# EAGLE design duckypad_evo (EAGLE 9.6.2)
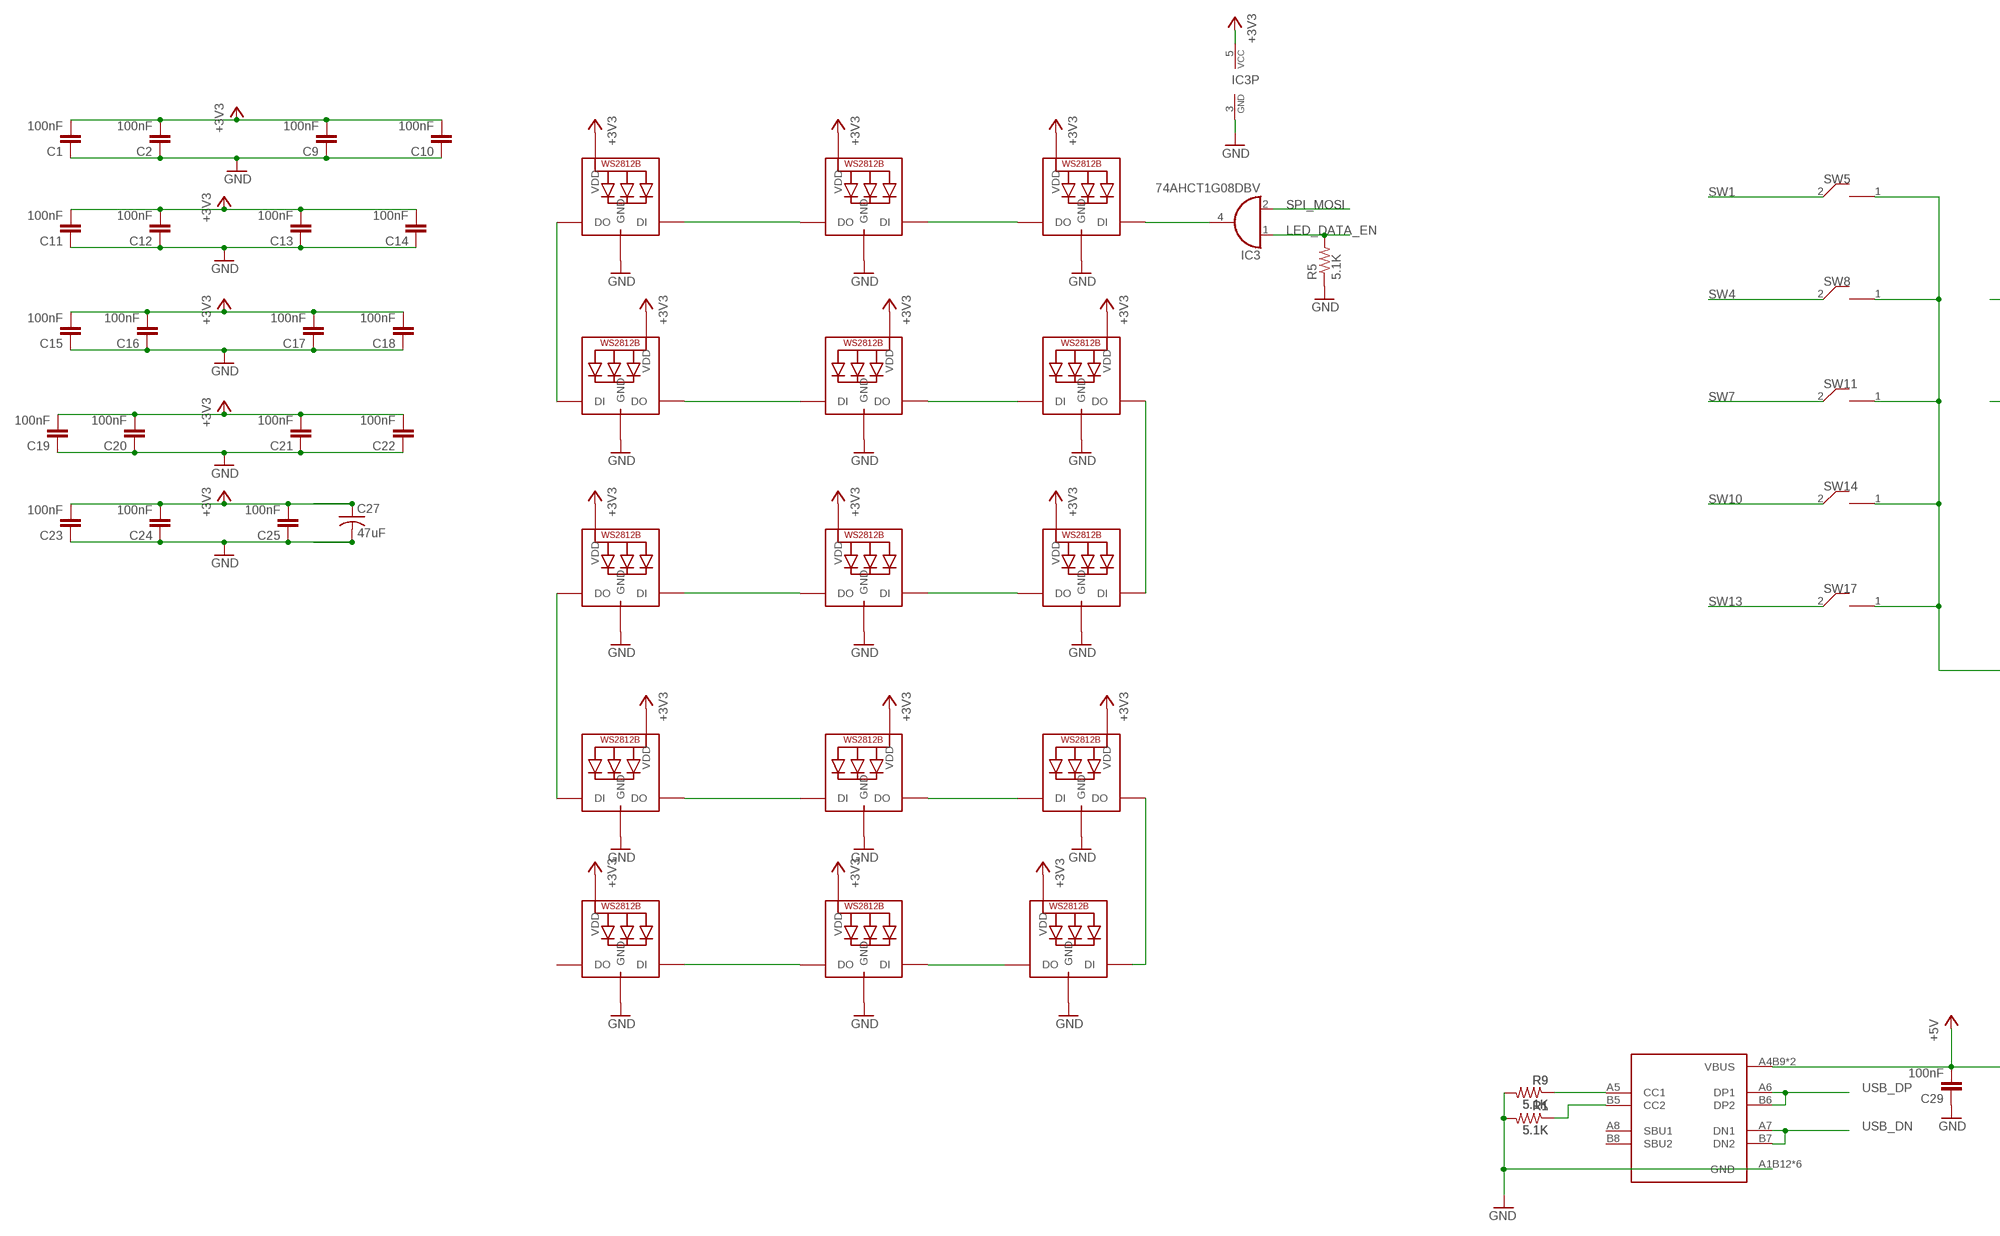
[diagram p0: schematic, sheet 1, part 1 of 2]
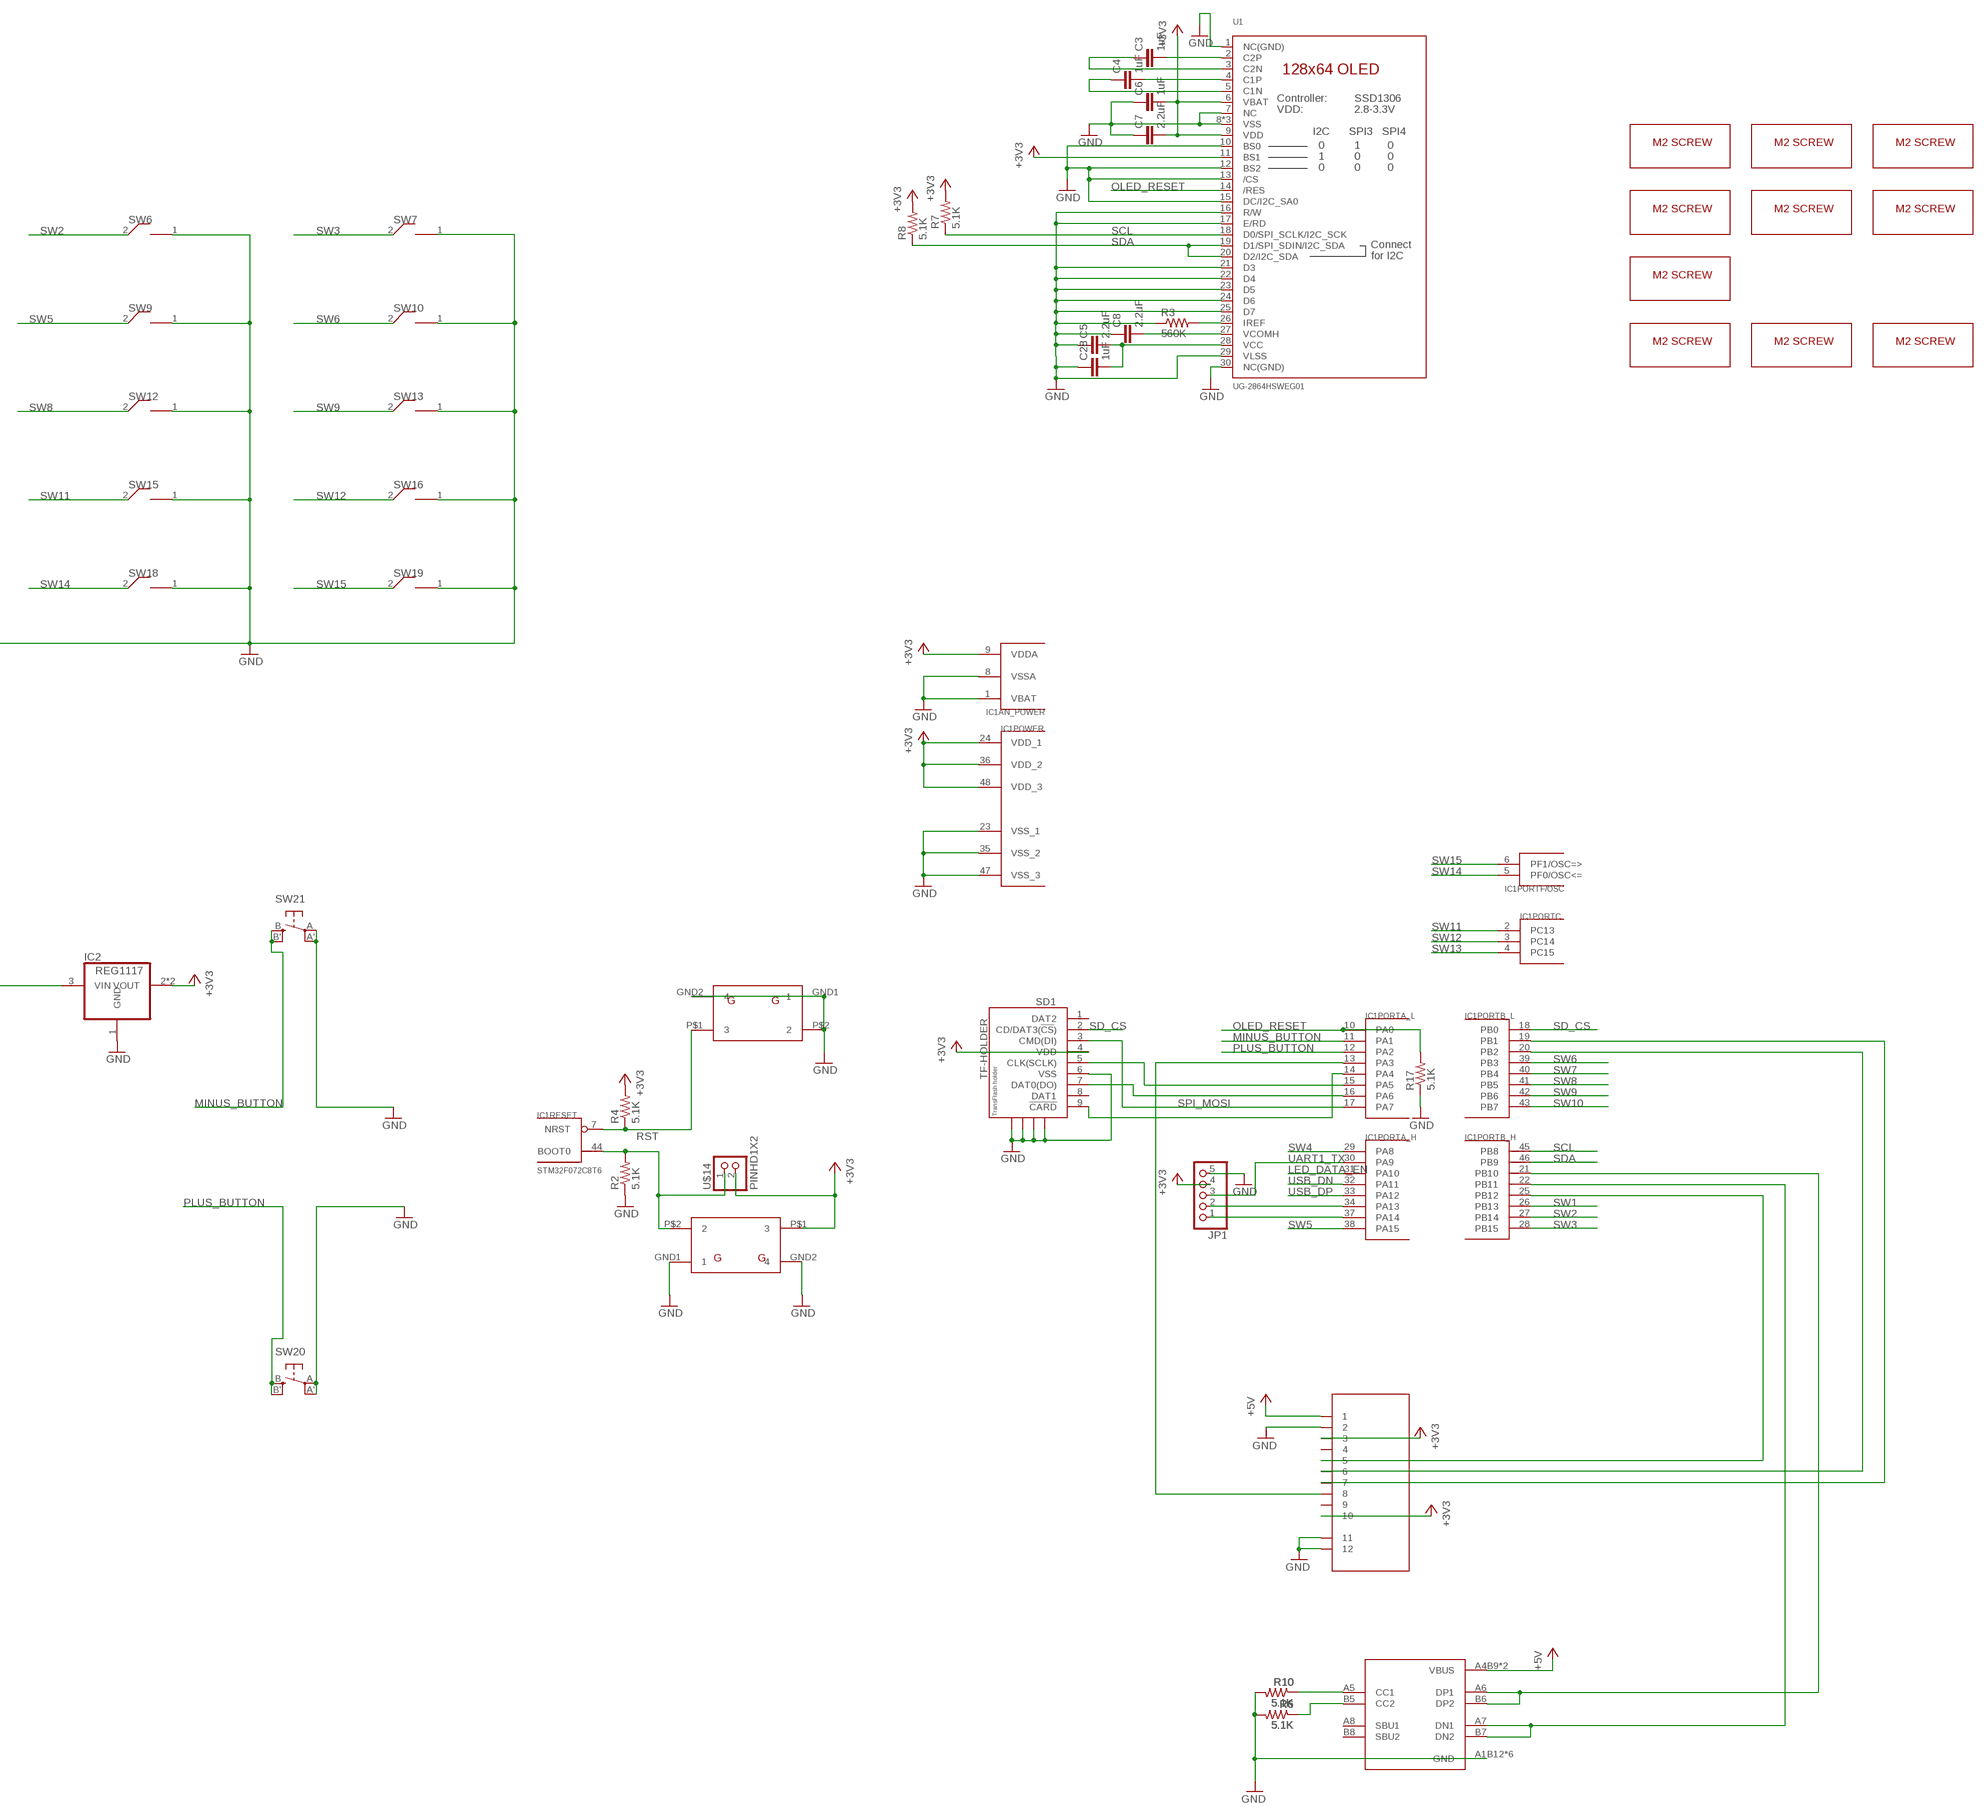
[diagram p1: schematic, sheet 1, part 2 of 2]

## Parts
C1  100nF  CAP0805  [0805@1]
C2  100nF  CAP0805  [0805@1]
C3  1uF  CAP0805  [0805@1]
C4  1uF  CAP0805  [0805@1]
C5  2.2uF  CAP0805  [0805@1]
C6  1uF  CAP0805  [0805@1]
C7  2.2uF  CAP0805  [0805@1]
C8  2.2uF  CAP0805  [0805@1]
C9  100nF  CAP0805  [0805@1]
C10  100nF  CAP0805  [0805@1]
C11  100nF  CAP0805  [0805@1]
C12  100nF  CAP0805  [0805@1]
C13  100nF  CAP0805  [0805@1]
C14  100nF  CAP0805  [0805@1]
C15  100nF  CAP0805  [0805@1]
C16  100nF  CAP0805  [0805@1]
C17  100nF  CAP0805  [0805@1]
C18  100nF  CAP0805  [0805@1]
C19  100nF  CAP0805  [0805@1]
C20  100nF  CAP0805  [0805@1]
C21  100nF  CAP0805  [0805@1]
C22  100nF  CAP0805  [0805@1]
C23  100nF  CAP0805  [0805@1]
C24  100nF  CAP0805  [0805@1]
C25  100nF  CAP0805  [0805@1]
C27  47uF  C-USC1210  [C1210]
C28  1uF  CAP0805  [0805@1]
C29  100nF  CAP0805  [0805@1]
IC1  STM32F072C8T6  [TQFP48]
IC2  REG1117  [SOT223]
IC3  74AHCT1G08DBV  [SOT23-5]
JP1  PINHD-1X5  [1X05]
LED1  WS2812B  [REVERSE_MNT]
LED2  WS2812B  [REVERSE_MNT]
LED3  WS2812B  [REVERSE_MNT]
LED4  WS2812B  [REVERSE_MNT]
LED5  WS2812B  [REVERSE_MNT]
LED6  WS2812B  [REVERSE_MNT]
LED7  WS2812B  [REVERSE_MNT]
LED8  WS2812B  [REVERSE_MNT]
LED9  WS2812B  [REVERSE_MNT]
LED10  WS2812B  [REVERSE_MNT]
LED11  WS2812B  [REVERSE_MNT]
LED12  WS2812B  [REVERSE_MNT]
LED13  WS2812B  [REVERSE_MNT]
LED14  WS2812B  [REVERSE_MNT]
LED15  WS2812B  [REVERSE_MNT]
R1  5.1K  RESISTOR0805-RES  [0805]
R2  5.1K  RESISTOR0805-RES  [0805]
R3  560K  RESISTOR0805-RES  [0805]
R4  5.1K  RESISTOR0805-RES  [0805]
R5  5.1K  RESISTOR0805-RES  [0805]
R6  5.1K  RESISTOR0805-RES  [0805]
R7  5.1K  RESISTOR0805-RES  [0805]
R8  5.1K  RESISTOR0805-RES  [0805]
R9  5.1K  RESISTOR0805-RES  [0805]
R10  5.1K  RESISTOR0805-RES  [0805]
R17  5.1K  RESISTOR0805-RES  [0805]
SD1  TF-HOLDER  [TF-PULL]
SH1  SH10P  [DUCKYPAD_SM12B-SSR-H-TB]
SW3  3POS_SLIDE_SWITCH_324_SW  [SIDEPUSH]
SW4  3POS_SLIDE_SWITCH_324_SW  [SIDEPUSH]
SW5  KAILH_SWITCH_SOCKET_KAILH_SWITCH_SOCKET  [KAILH_SWITCH_SOCKET_SWITCH_SOCKET]
SW6  KAILH_SWITCH_SOCKET_KAILH_SWITCH_SOCKET  [KAILH_SWITCH_SOCKET_SWITCH_SOCKET]
SW7  KAILH_SWITCH_SOCKET_KAILH_SWITCH_SOCKET  [KAILH_SWITCH_SOCKET_SWITCH_SOCKET]
SW8  KAILH_SWITCH_SOCKET_KAILH_SWITCH_SOCKET  [KAILH_SWITCH_SOCKET_SWITCH_SOCKET]
SW9  KAILH_SWITCH_SOCKET_KAILH_SWITCH_SOCKET  [KAILH_SWITCH_SOCKET_SWITCH_SOCKET]
SW10  KAILH_SWITCH_SOCKET_KAILH_SWITCH_SOCKET  [KAILH_SWITCH_SOCKET_SWITCH_SOCKET]
SW11  KAILH_SWITCH_SOCKET_KAILH_SWITCH_SOCKET  [KAILH_SWITCH_SOCKET_SWITCH_SOCKET]
SW12  KAILH_SWITCH_SOCKET_KAILH_SWITCH_SOCKET  [KAILH_SWITCH_SOCKET_SWITCH_SOCKET]
SW13  KAILH_SWITCH_SOCKET_KAILH_SWITCH_SOCKET  [KAILH_SWITCH_SOCKET_SWITCH_SOCKET]
SW14  KAILH_SWITCH_SOCKET_KAILH_SWITCH_SOCKET  [KAILH_SWITCH_SOCKET_SWITCH_SOCKET]
SW15  KAILH_SWITCH_SOCKET_KAILH_SWITCH_SOCKET  [KAILH_SWITCH_SOCKET_SWITCH_SOCKET]
SW16  KAILH_SWITCH_SOCKET_KAILH_SWITCH_SOCKET  [KAILH_SWITCH_SOCKET_SWITCH_SOCKET]
SW17  KAILH_SWITCH_SOCKET_KAILH_SWITCH_SOCKET  [KAILH_SWITCH_SOCKET_SWITCH_SOCKET]
SW18  KAILH_SWITCH_SOCKET_KAILH_SWITCH_SOCKET  [KAILH_SWITCH_SOCKET_SWITCH_SOCKET]
SW19  KAILH_SWITCH_SOCKET_KAILH_SWITCH_SOCKET  [KAILH_SWITCH_SOCKET_SWITCH_SOCKET]
SW20  SPST_TACT-EVQQ2  [EVQ-Q2]
SW21  SPST_TACT-EVQQ2  [EVQ-Q2]
U1  UG-2864HSWEG01  LUL_DISP_OLED_UG-2864HSWEG01  [LUL_UG-2864HSWEG01_1.3_WRAPAROUND]
U2  USBC_16P  [USBC_16P_FOOT]
U3  USBC_16P  [USBC_16P_FOOT]
U$7  M2_SCREW_DEV  [M2_SCREW_FOOT]
U$8  M2_SCREW_DEV  [M2_SCREW_FOOT]
U$9  M2_SCREW_DEV  [M2_SCREW_FOOT]
U$10  M2_SCREW_DEV  [M2_SCREW_FOOT]
U$11  M2_SCREW_DEV  [M2_SCREW_FOOT]
U$12  M2_SCREW_DEV  [M2_SCREW_FOOT]
U$13  M2_SCREW_DEV  [M2_SCREW_FOOT]
U$14  PINHD1X2  [1X02]
U$15  M2_SCREW_DEV  [M2_SCREW_FOOT]
U$16  M2_SCREW_DEV  [M2_SCREW_FOOT]
U$23  M2_SCREW_DEV  [M2_SCREW_FOOT]

## Nets
+3V3: C1.2 C2.2 C6.2 C7.2 C9.2 C10.2 C11.2 C12.2 C13.2 C14.2 C15.2 C16.2 C17.2 C18.2 C19.2 C20.2 C21.2 C22.2 C23.2 C24.2 C25.2 C27.1 IC1.9(AN_POWER:VDDA) IC1.24(POWER:VDD_1) IC1.36(POWER:VDD_2) IC1.48(POWER:VDD_3) IC2.2(VOUT) IC2.4(VOUT) IC3.5(VCC) JP1.4 LED1.VDD LED2.VDD LED3.VDD LED4.VDD LED5.VDD LED6.VDD LED7.VDD LED8.VDD LED9.VDD LED10.VDD LED11.VDD LED12.VDD LED13.VDD LED14.VDD LED15.VDD R4.2 R7.2 R8.2 SD1.4(VDD) SH1.3 SH1.10 SW4.P$1 U1.6(VBAT) U1.9(VDD) U1.11(BS1) U$14.2
+5V: C29.2 IC2.3(VIN) SH1.1 U2.A4B9(VBUS) U2.B4A9(VBUS) U3.A4B9(VBUS) U3.B4A9(VBUS)
BUTTON_DEBUG: IC1.44(RESET:BOOT0) R2.2 SW4.P$2 U$14.1
GND: C1.1 C2.1 C5.1 C6.1 C7.1 C8.1 C9.1 C10.1 C11.1 C12.1 C13.1 C14.1 C15.1 C16.1 C17.1 C18.1 C19.1 C20.1 C21.1 C22.1 C23.1 C24.1 C25.1 C27.2 C28.1 C29.1 IC1.1(AN_POWER:VBAT) IC1.8(AN_POWER:VSSA) IC1.23(POWER:VSS_1) IC1.35(POWER:VSS_2) IC1.47(POWER:VSS_3) IC2.1(GND) IC3.3(GND) JP1.5 LED1.GND LED2.GND LED3.GND LED4.GND LED5.GND LED6.GND LED7.GND LED8.GND LED9.GND LED10.GND LED11.GND LED12.GND LED13.GND LED14.GND LED15.GND R1.2 R2.1 R3.1 R5.1 R6.2 R9.2 R10.2 R17.1 SD1.6(VSS) SD1.S1 SD1.S2 SD1.S3 SD1.S4 SH1.2 SH1.FIT@1 SH1.FIT@2 SW3.GND1 SW3.GND2 SW3.P$2 SW4.GND1 SW4.GND2 SW5.1 SW6.1 SW7.1 SW8.1 SW9.1 SW10.1 SW11.1 SW12.1 SW13.1 SW14.1 SW15.1 SW16.1 SW17.1 SW18.1 SW19.1 SW20.A'(P1) SW20.A(P) SW21.A'(P1) SW21.A(P) U1.1(NC(GND)) U1.7(NC) U1.8(VSS) U1.10(BS0) U1.12(BS2) U1.13(/CS) U1.15(DC/I2C_SA0) U1.16(R/W) U1.17(E/RD) U1.21(D3) U1.22(D4) U1.23(D5) U1.24(D6) U1.25(D7) U1.29(VLSS) U1.30(NC(GND)) U1.31(VSS) U1.32(VSS) U2.A1B12(GND) U2.B11A12(GND) U2.P$13(GND) U2.P$14(GND) U2.P$15(GND) U2.P$16(GND) U3.A1B12(GND) U3.B11A12(GND) U3.P$13(GND) U3.P$14(GND) U3.P$15(GND) U3.P$16(GND)
LED_DATA_EN: IC1.31(PORTA_H:PA10) IC3.1(I0) R5.2
MINUS_BUTTON: IC1.11(PORTA_L:PA1) SW21.B'(S1) SW21.B(S)
N$1: R6.1 U3.B5(CC2)
N$2: IC1.20(PORTB_L:PB2) SH1.6
N$3: R3.2 U1.26(IREF)
N$4: C3.2 U1.2(C2P)
N$5: C3.1 U1.3(C2N)
N$6: C4.2 U1.4(C1P)
N$7: C4.1 U1.5(C1N)
N$8: IC1.15(PORTA_L:PA5) SD1.5(CLK(SCLK))
N$9: LED2.DIN(DI) LED3.DOUT(DO)
N$10: IC1.16(PORTA_L:PA6) SD1.7(DAT0(DO))
N$11: C5.2 C28.2 U1.28(VCC)
N$12: C8.2 U1.27(VCOMH)
N$13: IC1.19(PORTB_L:PB1) SH1.7
N$14: IC1.14(PORTA_L:PA4) SD1.9(!CARD)
N$15: LED1.DIN(DI) LED2.DOUT(DO)
N$16: IC1.22(PORTB_H:PB11) U3.A7(DN1) U3.B7(DN2)
N$17: LED1.DOUT(DO) LED4.DIN(DI)
N$18: LED4.DOUT(DO) LED5.DIN(DI)
N$19: LED5.DOUT(DO) LED6.DIN(DI)
N$20: LED6.DOUT(DO) LED9.DIN(DI)
N$21: LED8.DIN(DI) LED9.DOUT(DO)
N$22: LED7.DIN(DI) LED8.DOUT(DO)
N$23: LED7.DOUT(DO) LED10.DIN(DI)
N$24: LED10.DOUT(DO) LED11.DIN(DI)
N$25: LED11.DOUT(DO) LED12.DIN(DI)
N$26: LED12.DOUT(DO) LED15.DIN(DI)
N$27: LED14.DIN(DI) LED15.DOUT(DO)
N$28: LED13.DIN(DI) LED14.DOUT(DO)
N$29: IC3.4(O) LED3.DIN(DI)
N$30: IC1.21(PORTB_H:PB10) U3.A6(DP1) U3.B6(DP2)
N$31: R1.1 U2.B5(CC2)
N$32: IC1.37(PORTA_H:PA14) JP1.1
N$33: R9.1 U2.A5(CC1)
N$34: IC1.34(PORTA_H:PA13) JP1.2
N$35: IC1.25(PORTB_H:PB12) SH1.5
N$36: R10.1 U3.A5(CC1)
N$37: IC1.13(PORTA_L:PA3) SH1.8
OLED_RESET: IC1.10(PORTA_L:PA0) R17.2 U1.14(/RES)
PLUS_BUTTON: IC1.12(PORTA_L:PA2) SW20.B'(S1) SW20.B(S)
RST: IC1.7(RESET:NRST) R4.1 SW3.P$1
SCL: IC1.45(PORTB_H:PB8) R7.1 U1.18(D0/SPI_SCLK/I2C_SCK)
SD_CS: IC1.18(PORTB_L:PB0) SD1.2(CD/DAT3(!CS!))
SDA: IC1.46(PORTB_H:PB9) R8.1 U1.19(D1/SPI_SDIN/I2C_SDA) U1.20(D2/I2C_SDA)
SPI_MOSI: IC1.17(PORTA_L:PA7) IC3.2(I1) SD1.3(CMD(DI))
SW1: IC1.26(PORTB_H:PB13) SW5.2
SW2: IC1.27(PORTB_H:PB14) SW6.2
SW3: IC1.28(PORTB_H:PB15) SW7.2
SW4: IC1.29(PORTA_H:PA8) SW8.2
SW5: IC1.38(PORTA_H:PA15) SW9.2
SW6: IC1.39(PORTB_L:PB3) SW10.2
SW7: IC1.40(PORTB_L:PB4) SW11.2
SW8: IC1.41(PORTB_L:PB5) SW12.2
SW9: IC1.42(PORTB_L:PB6) SW13.2
SW10: IC1.43(PORTB_L:PB7) SW14.2
SW11: IC1.2(PORTC:PC13) SW15.2
SW12: IC1.3(PORTC:PC14) SW16.2
SW13: IC1.4(PORTC:PC15) SW17.2
SW14: IC1.5(PORTF/OSC:PF0/OSC<=) SW18.2
SW15: IC1.6(PORTF/OSC:PF1/OSC=>) SW19.2
UART1_TX: IC1.30(PORTA_H:PA9) JP1.3
USB_DN: IC1.32(PORTA_H:PA11) U2.A7(DN1) U2.B7(DN2)
USB_DP: IC1.33(PORTA_H:PA12) U2.A6(DP1) U2.B6(DP2)
Unconnected: LED13.DOUT(DO) SD1.1(DAT2) SD1.8(DAT1) SH1.4 SH1.9 U2.A8(SBU1) U2.B8(SBU2) U3.A8(SBU1) U3.B8(SBU2)

## Library data of the parts
C1-C25 C28 C29 = clock:CAP: Capacitor Standard 0603 ceramic capacitor, and 0.1" leaded capacitor.
C27 = clock:C-US: CAPACITOR, American symbol
IC1 = clock:STM32F072C8T6: ST STM32F072 48pin LQFP
IC2 = clock:REG1117: 800mA and 1A Low Dropout (LDO) Positive Regulator 1.8V, 2.5V, 2.85V, 3.3V, 5V, and Adj; MPN: REG1117; OC_FARNELL: 1097566; OC_NEWARK: 14P6981
IC3 = 74xx-little-de:74*1G08: 2-input AND gate
JP1 = pinhead:PINHD-1X5: PIN HEADER
LED1-LED15 = lul:WS2812B
R1 R6 R9 R10 = joyAnalog:RESISTOR: Resistor Basic schematic elements and footprints for 0603, 1206, and PTH resistors.
R2-R5 R7 R8 R17 = clock:RESISTOR: Resistor Basic schematic elements and footprints for 0603, 1206, and PTH resistors.
SD1 = clock:TF-HOLDER: TF / Micro SD socket is PUSH-PUSH type, the card can be pushed into and auto locked and pushed out by simply press the card. Surface Mounting type.
SH1 = duckypad:SH10P
SW3 SW4 = duckypad:3POS_SLIDE_SWITCH_324_SW
SW5-SW19 = lul:KAILH_SWITCH_SOCKET_KAILH_SWITCH_SOCKET
SW20 SW21 = duckypad:SPST_TACT: SMT 6mm switch, EVQQ2 series http://www.ladyada.net/library/eagle
U1 = lul:LUL_DISP_OLED_UG-2864HSWEG01: UG-2864HSWEG01 OLED display Both 1.3" and 0.96" models share the same FPC tab footprint, only the screen dimensions vary.
U2 U3 = my_usbc_16p:USBC_16P
U$7-U$13 U$15 U$16 U$23 = 3pos_slide_switch_centered:M2_SCREW_DEV
U$14 = adafruit_changed:PINHD1X2

## Board
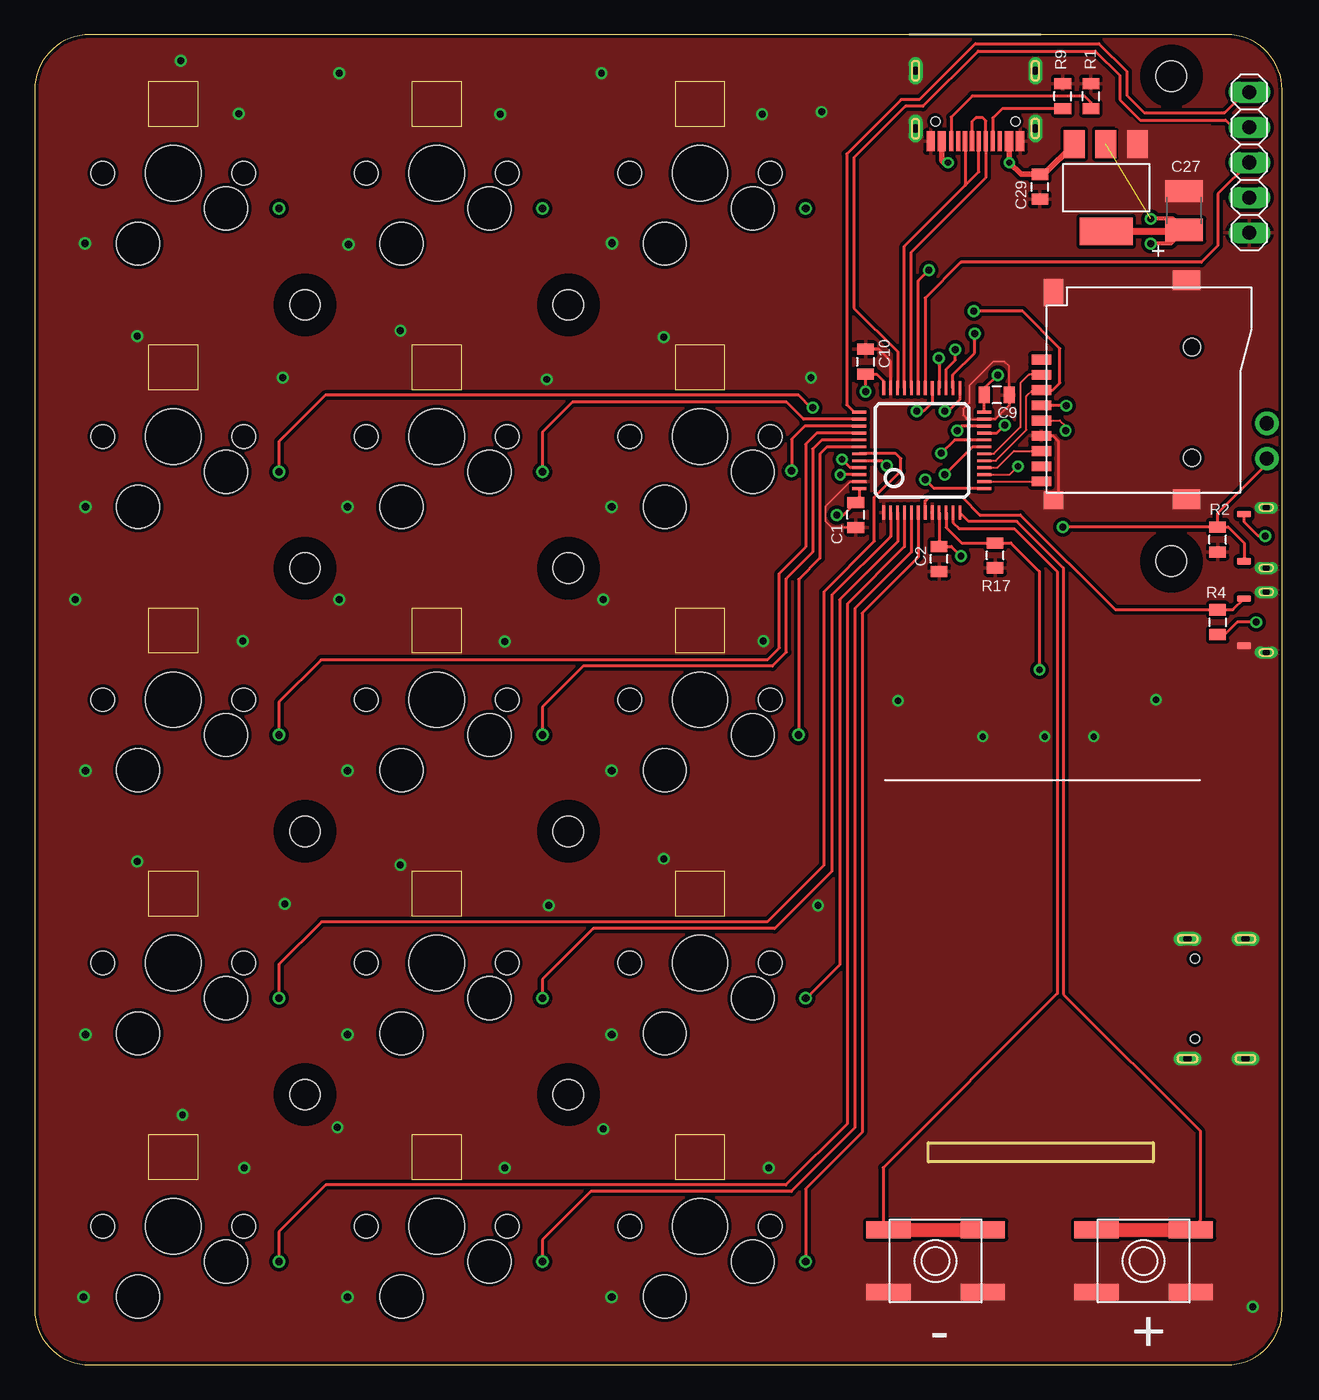
[diagram p2: board, top side]
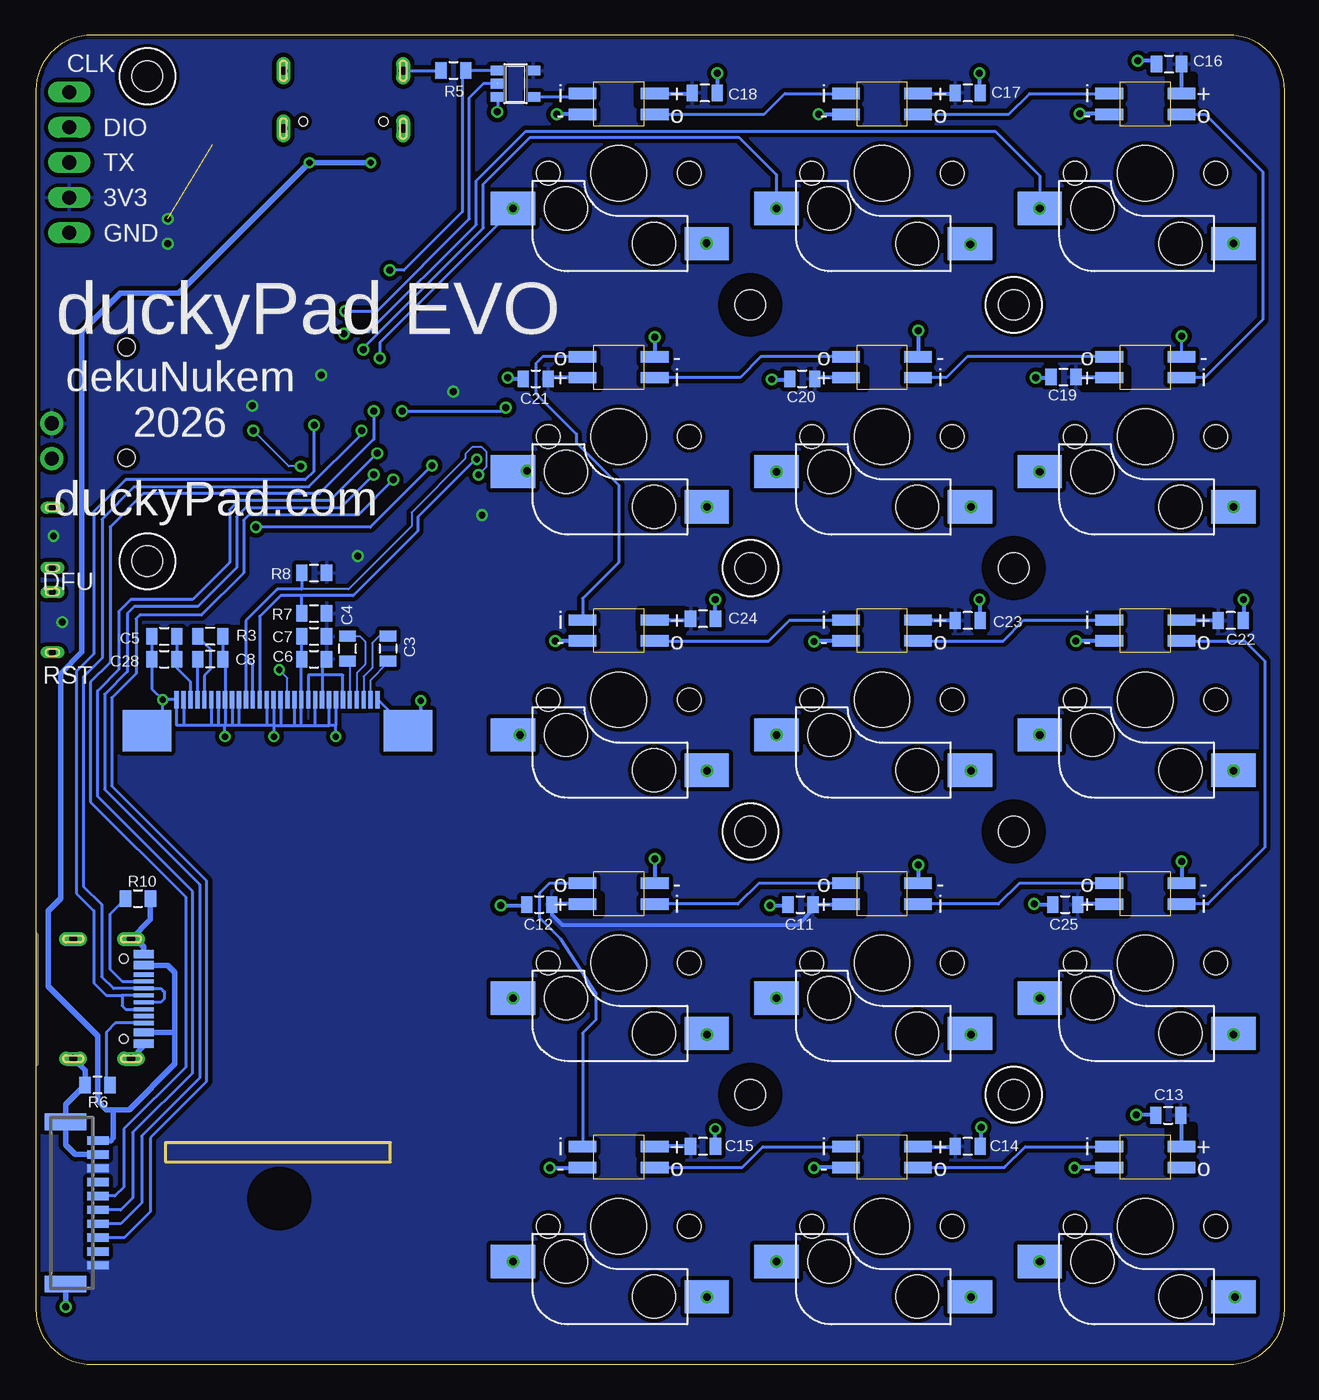
[diagram p3: board, bottom side, seen from below]

Size 90 x 96 mm. Coordinates in mm from the lower left corner, seen from the top.
Outline: 0,92 0,4 arc90 4,0 86,0 arc90 90,4 90,92 arc90 86,96 4,96 arc90 0,92
Copper layers (1*16): Top 0.035mm / dielectric 1.5mm / Bottom 0.035mm
Design rules "deku_2layer_6mil *": minimum track width 6mil, minimum drill 15mil, track to track 6mil, track to pad 6mil, pad to pad 6mil, via to via 6mil, smd to smd 6mil, copper to edge 10mil, drill to drill 6mil, minimum pad ring 7mil, minimum via ring 7mil, stop-mask expansion 4mil, vias tented up to drill 25mil, thermal gap 10mil
tRestrict: area 36.5,74.5 to 40.5,78.5; area 80,91 to 84,95; area 80,56 to 84,60; area 17.5,74.5 to 21.5,78.5; area 17.5,55.5 to 21.5,59.5; area 36.5,55.5 to 40.5,59.5; area 36.5,36.5 to 40.5,40.5; area 17.5,17.5 to 21.5,21.5; area 36.5,17.5 to 40.5,21.5; area 17.5,36.5 to 21.5,40.5
bRestrict: area 67.8,49 to 70.9,50.1; area 69.6,51 to 70.4,52.7; area 43.4,90.9 to 46.6,92.3; area 24.3,91.1 to 27.4,92.5; area 5.2,53 to 8.4,54.4; area 24.3,53 to 27.4,54.4; area 43.3,53.1 to 46.5,54.5; area 24.3,15.1 to 27.4,16.5; area 43.3,15.1 to 46.5,16.5; area 11.3,70.5 to 14.5,71.9; area 30.2,70.5 to 33.4,71.9; area 49.4,70.5 to 52.6,71.9; 23 more areas
Milling: area 64.5,14.6 to 80.7,16

### Footprints (pad centres in the part's own frame; a part is rotated, then mirrored left to right if it is on the bottom)
0805@1 = smd 0.8 x 1.2: 1 -0.9,0; 2 0.9,0
C1210 = smd 1.6 x 2.7: 1 -1.4,0; 2 1.4,0
TQFP48 = smd 0.2 x 1: 1 -2.75,-4.5; 2 -2.25,-4.5; 3 -1.75,-4.5; 4 -1.25,-4.5; 5 -0.75,-4.5; 6 -0.25,-4.5; 7 0.25,-4.5; 8 0.75,-4.5; 9 1.25,-4.5; 10 1.75,-4.5; 11 2.25,-4.5; 12 2.75,-4.5; 25 2.75,4.5; 26 2.25,4.5; 27 1.75,4.5; 28 1.25,4.5; 29 0.75,4.5; 30 0.25,4.5; 31 -0.25,4.5; 32 -0.75,4.5; 33 -1.25,4.5; 34 -1.75,4.5; 35 -2.25,4.5; 36 -2.75,4.5 | smd 1 x 0.2: 13 4.5,-2.75; 14 4.5,-2.25; 15 4.5,-1.75; 16 4.5,-1.25; 17 4.5,-0.75; 18 4.5,-0.25; 19 4.5,0.25; 20 4.5,0.75; 21 4.5,1.25; 22 4.5,1.75; 23 4.5,2.25; 24 4.5,2.75; 37 -4.5,2.75; 38 -4.5,2.25; 39 -4.5,1.75; 40 -4.5,1.25; 41 -4.5,0.75; 42 -4.5,0.25; 43 -4.5,-0.25; 44 -4.5,-0.75; 45 -4.5,-1.25; 46 -4.5,-1.75; 47 -4.5,-2.25; 48 -4.5,-2.75
SOT223 = smd 1.499 x 2.007: 1 -2.261,-3.15; 2 0.025,-3.15; 3 2.311,-3.15 | smd 3.81 x 2.007: 4 0,3.15
SOT23-5 = smd 0.69 x 0.99: 1 -0.95,-1.29; 2 0,-1.29; 3 0.95,-1.29; 4 0.95,1.3; 5 -0.95,1.3
1X05 = drill 1.016 long: 1 -5.08,0; 2 -2.54,0; 3 0,0; 4 2.54,0; 5 5.08,0
REVERSE_MNT = smd 2 x 0.82 bottom: DIN -2.6,-0.75; DOUT 2.6,0.75; GND -2.6,0.75; VDD 2.6,-0.75
0805 = smd 0.8 x 1.2: 1 -0.9,0; 2 0.9,0
TF-PULL = smd 0.7 x 1.4: 1 -2.2,-7.62; 2 -1.1,-7.62; 3 0,-7.62; 4 1.1,-7.62; 5 2.2,-7.62; 6 3.3,-7.62; 7 4.4,-7.62; 8 5.5,-7.62; 9 6.6,-7.62 | smd 1.4 x 2: S1 -7.9,2.85; S2 7.9,2.85 | smd 1.28 x 1.4: S3 7.96,-6.75 | smd 1.95 x 1.4: S4 -7.025,-6.75 | hole 1.25: -3.1,3.25; 4.9,3.25
DUCKYPAD_SM12B-SSR-H-TB = smd 0.6 x 1.55: 1 -4.5,1.925; 2 -3.5,1.925; 3 -2.5,1.925; 4 -1.5,1.925; 5 -0.5,1.925; 6 0.5,1.925; 7 1.5,1.925; 8 2.5,1.925; 9 3.5,1.925; 10 4.5,1.925 | smd 1.2 x 3: FIT@1 -5.85,-0.4; FIT@2 5.85,-0.4
SIDEPUSH = drill 0.5 pad 0.8 long: GND1 -2.175,1.6; GND2 2.175,1.6 | smd 0.5 x 1: P$1 -1.7,0; P$2 1.7,0
KAILH_SWITCH_SOCKET_SWITCH_SOCKET = smd 3.2 x 2.4 bottom: 1 6.355,5.08; 2 -7.625,2.54 | hole 4: 0,0 | hole 3.1: -3.81,2.54; 2.54,5.08 | hole 1.7: -5.08,0; 5.08,0
EVQ-Q2 = smd 3.2 x 1.2: A -3.4,-2.25; A' 3.4,-2.25; B -3.4,2.25; B' 3.4,2.25
LUL_UG-2864HSWEG01_1.3_WRAPAROUND = smd 0.31 x 1.28 bottom: 1 -7.25,0; 2 -6.75,0; 3 -6.25,0; 4 -5.75,0; 5 -5.25,0; 6 -4.75,0; 7 -4.25,0; 8 -3.75,0; 9 -3.25,0; 10 -2.75,0; 11 -2.25,0; 12 -1.75,0; 13 -1.25,0; 14 -0.75,0; 15 -0.25,0; 16 0.25,0; 17 0.75,0; 18 1.25,0; 19 1.75,0; 20 2.25,0; 21 2.75,0; 22 3.25,0; 23 3.75,0; 24 4.25,0; 25 4.75,0; 26 5.25,0; 27 5.75,0; 28 6.25,0; 29 6.75,0; 30 7.25,0 | smd 3.5 x 3 bottom: 31 -9.45,-2.24; 32 9.4,-2.24
USBC_16P_FOOT = smd 0.6 x 1.45: A1B12 -3.225,3.848; A4B9 -2.425,3.848; B4A9 2.425,3.848; B11A12 3.225,3.848 | smd 0.3 x 1.45: A5 -1.25,3.848; A6 -0.25,3.848; A7 0.25,3.848; A8 1.25,3.848; B5 1.75,3.848; B6 0.75,3.848; B7 -0.75,3.848; B8 -1.75,3.848 | drill 0.6 pad 1 long: P$13 -4.32,2.933; P$14 4.32,2.933; P$15 -4.32,-1.248; P$16 4.32,-1.248 | hole 0.65: -2.89,2.402; 2.89,2.402
M2_SCREW_FOOT = hole 2.2: 0,0
1X02 = drill 1.016 pad 1.676: 1 -1.27,0; 2 1.27,0

### Placement (x,y rotation side)
C1  59.23,61.34 90 top
C2  65.25,58.17 90 top
C3  64.64,51.69 270 bottom
C4  67.56,51.69 90 bottom
C5  80.77,52.58 0 bottom
C6  69.98,50.93 0 bottom
C7  69.98,52.58 0 bottom
C8  77.47,50.93 180 bottom
C9  69.42,70 180 top
C10  59.94,72.39 270 top
C11  34.88,33.22 0 bottom
C12  53.73,33.22 0 bottom
C13  8.35,18.01 0 bottom
C14  22.82,15.77 180 bottom
C15  41.92,15.77 180 bottom
C16  8.3,93.88 0 bottom
C17  22.82,91.79 180 bottom
C18  41.79,91.79 180 bottom
C19  15.91,71.3 0 bottom
C20  34.75,71.17 0 bottom
C21  53.98,71.17 0 bottom
C22  3.84,53.72 180 bottom
C23  22.82,53.72 180 bottom
C24  41.92,53.85 180 bottom
C25  15.78,33.22 0 bottom
C27  82.93,83.31 90 top
C28  80.77,50.93 0 bottom
C29  72.52,85.01 90 top
IC1  64,66 0 top
IC2  77.31,84.95 180 top
IC3  55.45,92.46 270 bottom
JP1  87.63,86.77 270 top
LED1  10,91 180 top
LED2  29,91 180 top
LED3  48,91 180 top
LED4  10,72 0 top
LED5  29,72 0 top
LED6  48,72 0 top
LED7  10,53 180 top
LED8  29,53 180 top
LED9  48,53 180 top
LED10  10,34 0 top
LED11  29,34 0 top
LED12  48,34 0 top
LED13  10,15 180 top
LED14  29,15 180 top
LED15  48,15 180 top
R1  76.2,91.57 90 top
R2  85.34,59.56 90 top
R3  77.47,52.58 180 bottom
R4  85.34,53.59 270 top
R5  59.92,93.42 0 bottom
R6  85.6,20.19 180 bottom
R7  69.98,54.23 0 bottom
R8  69.98,57.15 0 bottom
R9  74.17,91.57 90 top
R10  82.68,33.66 0 bottom
R17  69.29,58.42 90 top
SD1  80.25,70.35 270 top
SH1  87.5,11.68 270 bottom
SW3  87.25,53.59 270 top
SW4  87.25,59.69 270 top
SW5  10,86 180 top
SW6  29,86 180 top
SW7  48,86 180 top
SW8  10,67 180 top
SW9  29,67 180 top
SW10  48,67 180 top
SW11  10,48 180 top
SW12  29,48 180 top
SW13  48,48 180 top
SW14  10,29 180 top
SW15  29,29 180 top
SW16  48,29 180 top
SW17  10,10 180 top
SW18  29,10 180 top
SW19  48,10 180 top
SW20  80,7.5 0 top
SW21  65,7.5 0 top
U1  72.64,48.01 0 top
U2  67.87,92.15 180 top
U3  86.11,26.42 270 bottom
U$7  19.5,19.5 0 top
U$8  19.5,57.5 0 top
U$9  38.5,76.5 0 top
U$10  82,93 0 top
U$11  19.5,76.5 0 top
U$12  19.5,38.5 0 top
U$13  38.5,19.5 0 top
U$14  88.9,66.67 90 top
U$15  38.5,57.5 0 top
U$16  38.5,38.5 0 top
U$23  82,58 0 top

### Tracks (layer width: path | path; a pad name or v marks a point on that pad's centre or on a via)
+3V3  (via drill 0.5)  (1 unrouted)
  Top 0.203: v59.94,70.23 C10.2 60.77,71.49 61.25,71.01 IC1.36 | SD1.4 74.38,69.25 v74.42,69.22 | v69.47,71.42 68.52,70.47 C9.2 68.5,69.98 IC1.24 | v57.86,61.34 58.33,61.34 C1.2 59.5,62.51 IC1.48 | IC1.9 C2.2 66.13,59.07 v66.83,58.37 | v88.14,53.59 86.75,53.59 85.85,52.69 R4.2 | v88.77,59.82 88.27,59.82 87.25,60.83 SW4.P$1
  Top 0.305: v80.52,80.92 81.94,80.92 82.82,81.81 C27.1 82.14,82.7 v80.52,82.7
  Top 0.508: IC2.4 82.82,81.81
  Bottom 0.203: C6.2 69.39,50.61 69.39,49.78 | 69.39,49.78 U1.9 | U1.6 67.89,49.78 69.39,49.78 | 69.39,49.78 70.39,49.78 U1.11
  Bottom 0.305: LED2.VDD 23.76,91.75 C17.2 | LED3.VDD 42.73,91.75 C18.2 | LED9.VDD 42.91,53.75 C24.2 | LED8.VDD 23.75,53.75 C23.2 | 42.84,15.75 C15.2 45.38,15.77 LED15.VDD | LED14.VDD 23.74,15.75 C14.2 | C16.2 LED1.VDD | C22.2 7.37,53.72 LED7.VDD | LED11.VDD 31.63,33.22 C11.2 33.98,32.82 35.05,31.75 52.07,31.75 52.83,32.51 C12.2 52.8,33.25 LED12.VDD | C13.2 7.4,17.96 LED13.VDD | LED4.VDD 14.96,71.25 C19.2 | LED6.VDD 53,71.25 C21.2 | LED5.VDD 33.77,71.25 C20.2 | LED10.VDD 14.85,33.25 C25.2
  pour Bottom (isolate 0.305): 0,96.01 0,0 90.04,0 90.04,96.01
+5V  (via drill 0.45)
  Top 0.254: 70.29,86.81 v70.32,86.78 | 72.8,85.91 C29.2
  Top 0.305: v70.32,86.78 v70.31,86.77
  Top 0.406: U2.B4A9 65.44,86.96 65.63,86.77 v65.89,86.77 | U2.A4B9 70.29,86.81 | v70.31,86.77 71.16,85.91 C29.2 | IC2.3 72.8,85.91
  Bottom 0.406: v65.89,86.77 v70.31,86.77 79.73,77.34 83.95,77.34 86.74,74.55 86.74,51.44 88.27,49.91 88.27,33.66 89.15,32.77 89.15,27.3 85.6,23.75 85.6,19.05 84.96,18.41 84.45,18.41 | U3.A4B9 80.53,28.84 80.01,28.32 80.01,24 | 80.01,24 80.01,21.72 83.31,18.41 84.45,18.41 | U3.B4A9 80.02,23.99 80.01,24 | SH1.1 84.65,16.18 84.45,16.38 84.45,18.41
BUTTON_DEBUG  (via drill 0.5)
  Top 0.203: IC1.44 61.12,65.25 v61.47,64.9 | R2.2 v74.17,60.45 | R2.2 86.09,60.46 87.25,59.31 SW4.P$2 | R2.2 85.34,61.47 88.9,65.02 U$14.1
  Bottom 0.203: v61.47,64.9 65.91,60.45 v74.17,60.45
GND  (via drill 0.45, 0.5, 0.55)
  Top 0.152: C1.1 57.49,60.44 57.07,60.86 57.07,61.98 58.85,63.75 IC1.47 | 70.31,72.06 69.95,72.42 69.16,72.42 67.44,70.69 67.44,69.44 66.98,68.99 66.98,68.53 67.26,68.25 IC1.23 69.29,68.25 70.32,69.28 C9.1 70.31,70.01 70.31,72.06
  Top 0.203: IC1.35 61.75,72.44 60.9,73.29 C10.1 | SD1.6 73.46,67.05 73.86,66.65 73.86,62.76 SD1.S3
  Bottom 0.203: 70.89,46.15 U1.12 70.89,50.91 | 70.89,46.15 69.89,46.15 | U1.15 72.39,46.15 | 72.39,46.15 71.39,46.15 | 71.39,46.15 70.89,46.15 | U1.21 75.39,46.15 | 72.89,46.15 73.39,46.15 | 73.39,46.15 75.39,46.15 | 72.87,46.15 72.39,46.15 | 69.89,46.15 U1.10 | U1.32 80.9,46.91 v80.9,48.01 | 72.87,46.15 v72.87,45.34 | v56.77,90.42 56.74,90.45 IC3.3 | U2.P$16 60.84,93.4 R5.1 | U1.1 63.19,45.81 U1.31 | 70.89,50.91 C6.1 | C7.1 70.89,52.56 70.89,50.91 | 69.89,46.15 68.89,46.15 | 68.89,46.15 U1.8 | R3.1 C8.1 76.39,50.75 U1.23 76.39,46.15 | C5.1 C28.1 81.67,48.78 v80.9,48.01 | U1.7 68.39,46.15 | 68.39,46.15 68.89,46.15 | 75.39,46.15 75.89,46.15 | 75.89,46.15 76.39,46.15 | 76.39,46.15 76.4,46.15 | 76.4,46.15 76.89,46.15 | 76.89,46.15 77.39,46.15 | 77.39,46.15 79.39,46.15 | 79.39,46.15 79.89,46.15 U1.30 v80.9,48.01 | U1.29 79.39,46.15 | U1.24 76.89,46.15 | U1.22 75.89,46.15 | U1.13 71.39,46.15 | U1.16 72.89,46.15 | 72.89,46.15 72.87,46.15 | U1.17 73.39,46.15 | U1.25 77.39,46.15 | v7.39,74.24 v7.4,74.24 LED4.GND | v68.4,45.34 v68.39,45.35 68.39,46.15 | v76.4,45.34 76.4,46.15 | SW16.1 41.65,23.84 v41.63,23.82 | SW19.1 v41.63,4.9 | SW18.1 22.63,4.9 v22.58,4.9 | SW12.1 22.6,42.88 v22.58,42.88 | SW11.1 3.66,42.91 v3.66,42.88 | SW14.1 3.66,23.91 v3.66,23.82 | SW9.1 v22.59,61.92 v22.58,61.92 | SW13.1 41.65,42.89 v41.63,42.88 | SW8.1 v3.66,61.92 | SW7.1 41.65,80.94 v41.66,80.95 | SW10.1 v41.63,61.92 | SW6.1 22.64,80.89 v22.63,80.87 | SW15.1 22.64,23.89 v22.58,23.82 | SW5.1 v3.63,80.92 | SW17.1 3.63,4.9 v3.53,4.9
  Bottom 0.254: U1.31 62.28,46.68 v62.28,47.93
  Bottom 0.305: C16.1 9.42,94.11 v10.54,94.11 | v21.97,93.22 21.97,91.85 C17.1 | v40.89,93.22 C18.1 | v17.91,71.25 16.86,71.25 C19.1 | v56.01,71.25 55.93,71.17 C21.1 | v36.96,71.12 35.7,71.12 C20.1 | v2.92,55.24 2.92,53.74 C22.1 | C24.1 v41.02,55.24 | C23.1 21.92,55.19 v21.97,55.24 | v18.03,33.27 17.98,33.22 C25.1 | v37.08,33.15 35.86,33.15 C11.1 | v56.52,33.15 54.7,33.15 C12.1 | C15.1 v41.02,17.01 v41.02,17.02 | LED14.GND 33.88,14.25 v33.91,14.22 | C14.1 21.84,15.85 v21.84,17.14 | LED13.GND 15.09,14.25 v15.11,14.22 | C13.1 9.28,18.03 v10.67,18.03 | v52.96,14.22 50.63,14.22 LED15.GND | LED8.GND 33.86,52.25 v33.91,52.2 | v26.39,36.07 26.4,36.06 LED11.GND | v33.58,90.25 LED2.GND | LED1.GND 12.65,90.3 v14.73,90.3 | LED3.GND v52.47,90.25 v52.48,90.25 | v45.39,74.17 45.4,74.16 LED6.GND | LED7.GND v15.01,52.25 | v45.39,36.52 45.4,36.52 LED12.GND | LED9.GND v52.58,52.25 | v26.39,74.65 v26.4,74.64 LED5.GND | v7.39,36.32 LED10.GND
  Bottom 0.406: U3.P$16 86.5,21.24 R6.2 87.9,18.79 SH1.FIT@1 87.9,15.89 87.19,15.18 SH1.2 | SH1.FIT@2 87.9,4.21 v87.88,4.19 | R10.2 81.78,32.13 U3.P$13 82.85,30.74 82.26,30.15 U3.A1B12 | U3.P$14 82.26,23.01 U3.B11A12
  pour Top (isolate 0.254): 0,96 0,0 90,0 90,96
  pour Top (no thermals): 59.69,6.48 85.85,6.48 85.85,3.94 59.69,3.94
  pour Top (no thermals): 78.11,89.92 84.71,89.92 84.71,83.57 78.11,83.57
LED_DATA_EN  (via drill 0.5)
  Top 0.203: IC1.31 63.75,78.23 v64.52,78.99
  Bottom 0.203: IC3.1 59,93.41 R5.2 59.11,93.42 59.28,93.24 59.28,83.21 63.5,78.99 v64.52,78.99
MINUS_BUTTON
  Top 0.203: IC1.11 66.25,60.8 66.7,60.35 70.69,60.35 73.79,57.25 73.79,26.8 61.22,14.23 61.22,9.75 SW21.B
  Top 1.016: SW21.B SW21.B'
N$1
  Bottom 0.203: U3.B5 84.3,24.67 84.96,24 84.96,20.46 R6.1
N$2  (via drill 0.5)
  Top 0.203: IC1.20 66.37,66.75 v65.41,65.79
  Bottom 0.203: v65.41,65.79 68.83,62.36 75.44,62.36 76.07,61.72 76.07,57.91 78.74,55.24 83.19,55.24 84.07,54.36 84.07,50.16 85.6,48.64 85.6,41.02 78.74,34.16 78.74,21.08 83.06,16.76 83.06,12.06 83.94,11.18 SH1.6
N$3
  Bottom 0.203: R3.2 77.47,51.68 77.47,50.16 77.89,49.74 U1.26
N$4
  Bottom 0.152: C3.2 64.64,50.67 65.91,49.4 65.91,48.02 U1.2
N$5
  Bottom 0.152: C3.1 65.28,52.59 65.79,52.08 65.79,50.29 66.39,49.68 U1.3
N$6
  Bottom 0.152: C4.2 66.69,52.59 66.29,52.2 66.29,50.55 66.89,49.95 U1.4
N$7
  Bottom 0.152: C4.1 67.39,50.62 U1.5
N$8  (via drill 0.5)
  Top 0.152: IC1.15 70.35,64.25 v70.94,64.85 | SD1.5 73.96,68.15 74.37,67.74 v74.37,67.41
  Bottom 0.152: v70.94,64.85 71.81,64.85 v74.37,67.41
N$9
  Bottom 0.203: LED3.DOUT 37.51,90.25 36.01,91.75 LED2.DIN
N$10
  Top 0.152: IC1.16 69.45,64.75 70.65,65.95 SD1.7
N$11
  Bottom 0.203: U1.28 78.89,49.3 79.87,50.28 C28.2 C5.2
N$12
  Bottom 0.203: C8.2 78.39,50.9 U1.27
N$13  (via drill 0.5)
  Top 0.203: IC1.19 67.65,66.25 v65.66,64.26
  Bottom 0.203: v65.66,64.26 68.07,61.85 74.93,61.85 75.56,61.21 75.56,57.53 78.36,54.74 82.93,54.74 83.44,54.23 83.44,50.04 85.09,48.39 85.09,41.53 78.23,34.67 78.23,20.7 82.42,16.51 82.42,11.68 83.92,10.18 SH1.7
N$14
  Top 0.152: IC1.14 SD1.9
  Top 0.203: SD1.9
N$15
  Bottom 0.203: LED2.DOUT 19.86,90.25 18.36,91.75 LED1.DIN
N$16  (via drill 0.5)
  Top 0.203: IC1.22 66.86,67.75 v66.55,67.44
  Bottom 0.203: U3.A7 81.02,26.17 80.77,26.42 80.77,26.92 81.01,27.17 U3.B7 84.44,27.17 85.29,28.02 85.29,33.22 86.61,34.54 86.61,49.66 85.27,51 85.27,61.04 82.93,63.37 70.36,63.37 66.55,67.18 v66.55,67.44
N$17
  Bottom 0.203: LED1.DOUT 5.67,90.25 1.52,86.11 1.52,75.44 5.71,71.25 LED4.DIN
N$18
  Bottom 0.203: LED4.DOUT 22.86,72.75 24.36,71.25 LED5.DIN
N$19
  Bottom 0.203: LED5.DOUT 37.74,72.75 39.24,71.25 LED6.DIN
N$20
  Bottom 0.203: LED6.DOUT 53.49,72.75 53.98,72.26 53.98,70.1 51.05,67.18 51.05,66.55 48.01,63.5 48.01,57.91 50.6,55.32 LED9.DIN
N$21
  Bottom 0.203: LED9.DOUT 37.16,52.25 35.66,53.75 LED8.DIN
N$22
  Bottom 0.203: LED8.DOUT 20.27,52.25 18.77,53.75 LED7.DIN
N$23
  Bottom 0.203: LED7.DOUT 2.85,52.25 1.4,50.8 1.4,37.34 5.49,33.25 LED10.DIN
N$24
  Bottom 0.203: LED10.DOUT 19.1,34.75 20.6,33.25 LED11.DIN
N$25
  Bottom 0.203: LED11.DOUT 37.89,34.75 39.39,33.25 LED12.DIN
N$26
  Bottom 0.203: LED12.DOUT 53.01,34.75 53.72,34.04 53.72,32.29 52.2,30.77 49.66,26.82 49.66,24.89 50.6,23.95 LED15.DIN
N$27
  Bottom 0.203: LED15.DOUT 39.09,14.25 37.59,15.75 LED14.DIN
N$28
  Bottom 0.203: LED14.DOUT 20.17,14.25 18.67,15.75 LED13.DIN
N$29
  Bottom 0.203: IC3.4 50.84,91.51 LED3.DIN
N$30  (via drill 0.5)
  Top 0.203: IC1.21 69.41,67.25 v69.98,67.82
  Bottom 0.203: U3.A6 83.82,26.67 | U3.B6 83.58,25.67 83.82,25.91 83.82,26.67 | 83.82,26.67 84.96,26.67 85.85,27.56 85.85,32.77 87.12,34.04 87.12,50.04 85.88,51.28 85.88,61.57 83.57,63.88 70.61,63.88 69.98,64.52 v69.98,67.82
N$31
  Top 0.203: R1.1 76.2,91.11 75.74,91.57 67.64,91.57 66.12,90.05 U2.B5
N$32
  Top 0.203: IC1.37 59.11,68.75 58.57,69.29 58.57,87.38 62.51,91.31 63.83,91.31 67.87,95.35 76.78,95.35 78.79,93.34 78.79,91.62 80.03,90.37 85.85,90.37 87.33,91.85 JP1.1
N$33
  Top 0.203: R9.1 69.81,90.67 69.12,89.97 U2.A5
N$34
  Top 0.203: JP1.2 86.44,89.31 85.91,89.84 79.76,89.84 78.28,91.31 78.28,93.07 76.53,94.82 68.07,94.82 64.08,90.83 62.81,90.83 59.11,87.12 59.11,76.28 62.25,73.13 IC1.34
N$35  (via drill 0.5)
  Top 0.203: IC1.25 66.75,69.67 65.91,68.83 v65.66,68.83
  Bottom 0.203: v65.66,68.83 65.66,66.8 69.6,62.87 82.3,62.87 84.68,60.48 84.68,50.7 86.11,49.28 86.11,40.64 79.25,33.78 79.25,21.46 83.69,17.02 83.69,12.83 84.34,12.18 SH1.5
N$36
  Bottom 0.203: R10.1 84.71,32.52 84.71,28.57 83.8,27.67 U3.A5
N$37  (via drill 0.5)
  Top 0.203: IC1.13 64.89,63.25 v64.26,63.88
  Bottom 0.203: v64.26,63.88 66.8,61.34 74.68,61.34 75.06,60.96 75.06,57.15 78.11,54.1 82.55,54.1 82.8,53.85 82.8,49.91 84.58,48.13 84.58,41.78 77.72,34.92 77.72,20.45 81.79,16.38 81.79,11.05 83.65,9.18 SH1.8
OLED_RESET  (via drill 0.45)
  Top 0.203: IC1.10 65.75,60.44 66.87,59.32 R17.2 70.43,59.32 72.49,57.26 v72.49,50.16
  Bottom 0.152: U1.14 71.89,49.57 v72.49,50.16
PLUS_BUTTON
  Top 0.203: IC1.12 67.39,60.87 70.86,60.87 74.22,57.51 74.22,26.75 84.07,16.89 84.07,10.42 SW20.B'
  Top 1.016: SW20.B SW20.B'
RST
  Top 0.203: IC1.7 64.25,62.34 64.52,62.61 66.93,62.61 68.2,61.34 71.12,61.34 77.97,54.49 R4.1 86.45,54.49 SW3.P$1
SCL  (via drill 0.45)
  Top 0.203: IC1.45 58.85,64.75 v58.24,65.35
  Bottom 0.203: 70.87,55.52 67.16,55.52 62.48,60.19 62.48,61.19 58.32,65.35 v58.24,65.35 | 70.87,55.52 72.39,55.52 73.89,54.01 U1.18 | R7.1 70.87,54.24 70.87,55.52
SD_CS
  Top 0.152: IC1.18 69.2,65.75 71.12,67.67 71.12,70.84 71.73,71.45 SD1.2
SDA  (via drill 0.45)
  Top 0.203: IC1.46 v58.13,64.25 v58.12,64.24
  Bottom 0.152: v58.12,64.24 57.56,64.8 57.56,65.91 57.86,66.22 58.57,66.22 59.05,65.73 59.05,65.41 62.94,61.52 62.94,60.52 67.49,55.98 70.87,55.98
  Bottom 0.203: 74.89,51 74.89,53.7 72.62,55.98 70.87,55.98 70.88,55.99 R8.1 | 74.89,51 U1.20 | U1.19 74.39,50.5 74.89,51
SPI_MOSI  (via drill 0.5)
  Top 0.152: IC1.17 69.34,65.25 71.55,67.46 71.55,69.9 72,70.35 SD1.3
  Top 0.203: SD1.3 73.45,70.35 73.97,70.87 73.97,73.36 71.27,76.05 v67.74,76.05
  Bottom 0.203: IC3.2 57.78,92.46 58.78,91.47 58.78,82.7 65.43,76.05 v67.74,76.05
SW1  (via drill 0.5, 0.55)
  Top 0.203: IC1.26 66.25,71.46 67.82,73.03 v67.82,74.42
  Bottom 0.203: v67.82,74.42 67.69,74.55 66.02,74.55 58.27,82.3 58.27,85.47 54.71,89.03 20.83,89.03 17.62,85.82 SW5.2
  other vias: 17.62,83.46
SW2  (via drill 0.5, 0.55)
  Top 0.203: IC1.27 65.75,71.85 66.42,72.52 v66.42,73.28
  Bottom 0.203: v66.42,73.28 66.42,73.38 57.76,82.04 57.76,85.22 54.38,88.59 39.32,88.59 36.62,85.9 SW6.2
  other vias: 36.62,83.46
SW3  (via drill 0.5, 0.55)
  Top 0.203: v65.23,72.64 65.25,72.62 IC1.28
  Bottom 0.203: v65.23,72.64 65.23,73.76 55.62,83.36 SW7.2
  other vias: 55.62,83.46
SW4  (via drill 0.5, 0.55)
  Top 0.203: IC1.29 64.75,69.45 64.14,68.83 v63.63,68.83 | v56.13,69.09 56.01,69.09 55.12,69.98 20.95,69.98 17.62,66.65 SW8.2
  Bottom 0.203: v56.13,69.09 56.39,68.83 v63.63,68.83
  other vias: 17.62,64.46
SW5  (via drill 0.55)
  Top 0.203: IC1.38 55.47,68.25 54.25,69.47 38.79,69.47 36.62,67.31 SW9.2
  other vias: 36.62,64.46
SW6  (via drill 0.55)
  Top 0.203: IC1.39 55.56,67.75 54.61,66.8 v54.61,64.52
  Bottom 0.203: v54.61,64.52 55.57,64.52 SW10.2
SW7  (via drill 0.55)
  Top 0.203: IC1.40 56.43,67.25 55.63,66.45 55.63,59.03 53.72,57.12 53.72,51.74 52.86,50.88 20.68,50.88 17.62,47.83 SW11.2
  other vias: 17.62,45.46
SW8  (via drill 0.55)
  Top 0.203: IC1.41 56.79,66.75 56.13,66.09 56.13,58.65 54.23,56.74 54.23,51.44 53.21,50.42 39.57,50.42 36.62,47.47 SW12.2
  other vias: 36.62,45.46
SW9  (via drill 0.55)
  Top 0.203: IC1.42 57.16,66.25 56.64,65.73 56.64,58.22 55.12,56.69 v55.12,45.46
  Bottom 0.203: SW13.2 v55.12,45.46
SW10  (via drill 0.55)
  Top 0.203: IC1.43 62.14,65.75 62.48,65.41 62.48,64.52 60.58,62.61 60.58,59.44 56.95,55.8 56.95,36.07 52.86,31.98 20.7,31.98 17.62,28.9 SW14.2
  other vias: 17.62,26.46
SW11  (via drill 0.55)
  Top 0.203: IC1.2 61.75,59.79 57.53,55.58 57.53,35.64 53.39,31.5 40.31,31.5 36.62,27.81 SW15.2
  other vias: 36.62,26.46
SW12  (via drill 0.55)
  Top 0.203: IC1.3 62.25,59.41 58.06,55.22 58.06,28.85 55.67,26.46 SW16.2
  other vias: 55.62,26.46
SW13  (via drill 0.55)
  Top 0.203: IC1.4 62.75,59.04 58.62,54.91 58.62,17.4 54.2,12.98 21.01,12.98 17.62,9.6 SW17.2
  other vias: 17.62,7.46
SW14  (via drill 0.55)
  Top 0.203: IC1.5 63.25,58.65 59.18,54.59 59.18,17.12 54.59,12.52 40.13,12.52 36.62,9.02 SW18.2
  other vias: 36.62,7.46
SW15  (via drill 0.55)
  Top 0.203: IC1.6 63.75,58.31 59.69,54.25 59.69,16.76 55.62,12.7 SW19.2
  other vias: 55.62,7.46
UART1_TX
  Top 0.203: JP1.3 85.37,84.51 85.37,80.77 84.18,79.58 66.83,79.58 64.25,77 IC1.30
USB_DN
  Top 0.203: IC1.32 63.25,80.32 68.62,85.69 U2.B7 68.62,89.78 68.4,89.99 67.89,89.99 67.62,89.72 U2.A7
USB_DP
  Top 0.203: IC1.33 62.75,80.73 67.14,85.13 | 67.14,85.13 68.12,86.1 U2.A6 | 67.14,85.13 67.12,85.15 U2.B6

### Text on the board
tNames: - | +
bNames: CLK | DIO | TX | 3V3 | GND | duckyPad EVO | dekuNukem / 2026 | duckyPad.com | DFU | RST